# Altium schematic sheet pca10184_level_shifters.SchDoc: =ProductName + ' - Level Shifters'
size A3; Organization: Nordic Semiconductor; DocumentNumber: 4; SheetNumber: 4; SheetTotal: 9; CompanyName: Nordic Semiconductor; DocumentSize: A4
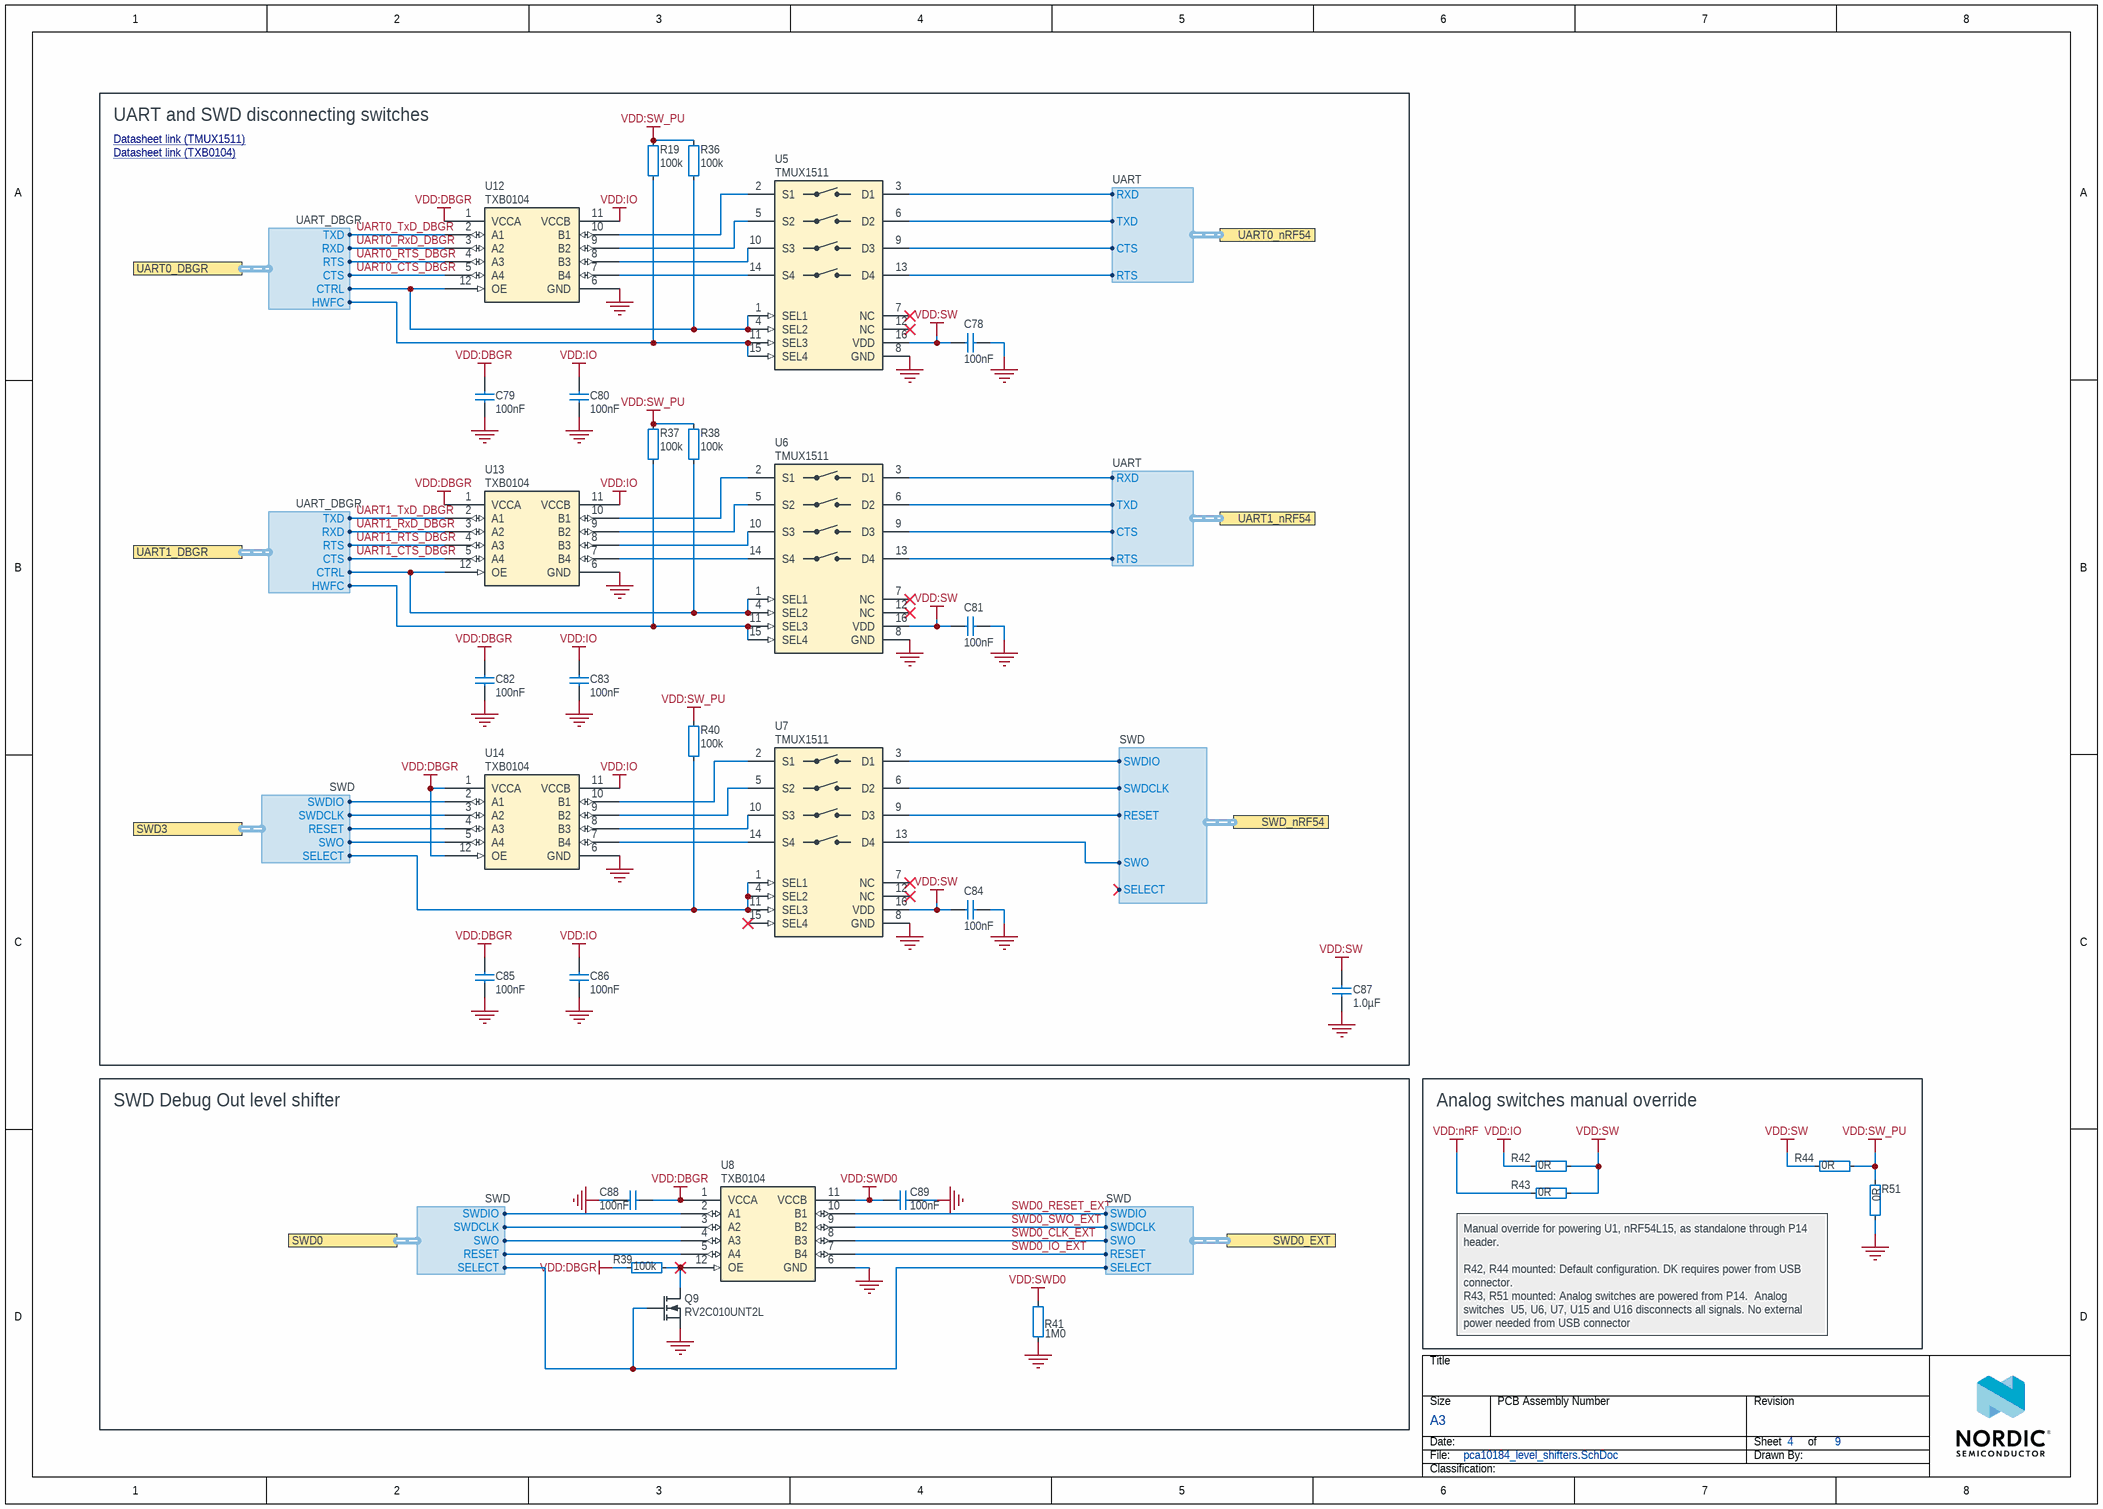
[diagram p0: pca10184_level_shifters.SchDoc]

## Parts
C78  100nF  [CAPC0603X03L_C]
C79  100nF  [CAPC0603X03L_C]
C80  100nF  [CAPC0603X03L_C]
C81  100nF  [CAPC0603X03L_C]
C82  100nF  [CAPC0603X03L_C]
C83  100nF  [CAPC0603X03L_C]
C84  100nF  [CAPC0603X03L_C]
C85  100nF  [CAPC0603X03L_C]
C86  100nF  [CAPC0603X03L_C]
C87  1.0µF  [CAPC1005X04L]
C88  100nF  [CAPC0603X03L_C]
C89  100nF  [CAPC0603X03L_C]
Q9  RV2C010UNT2L  [DFN65P100X40-3L]
R19  100k  [RESC0603X03L_C]
R36  100k  [RESC0603X03L_C]
R37  100k  [RESC0603X03L_C]
R38  100k  [RESC0603X03L_C]
R39  100k  [RESC0603X03L_C]
R40  100k  [RESC0603X03L_C]
R41  1M0  [RESC0603X03L_C]
R42  0R  [RESC1005X04L]
R43  0R  [RESC1005X04L]
R44  0R  [RESC1005X04L]
R51  0R  [RESC1005X04L]
U5  TMUX1511  [XQFN40P180X260X50-16N]
U6  TMUX1511  [XQFN40P180X260X50-16N]
U7  TMUX1511  [XQFN40P180X260X50-16N]
U8  TXB0104  [QFN12P40_170X200X55L50X20]
U12  TXB0104  [QFN12P40_170X200X55L50X20]
U13  TXB0104  [QFN12P40_170X200X55L50X20]
U14  TXB0104  [QFN12P40_170X200X55L50X20]

## Blocks framed on the sheet
UART and SWD disconnecting switches: C78-C87 R19 R36-R38 R40 U5-U7 U12-U14
SWD Debug Out level shifter: C88 C89 Q9 R39 R41 U8
Analog switches manual override: R42-R44 R51

## Ports
SWD0 (harness SWD), SWD0_EXT (harness SWD), SWD3 (harness SWD), SWD_nRF54 (harness SWD), UART0_DBGR (harness UART_DBGR), UART0_nRF54 (harness UART), UART1_DBGR (harness UART_DBGR), UART1_nRF54 (harness UART)

## Harnesses
SWD: SWDIO, SWDCLK, SWO, RESET, SELECT
UART_DBGR: RTS, CTS, RXD, TXD, HWFC, CTRL
UART: RTS, CTS, RXD, TXD

## Nets
GND: C78.2 C79.2 C80.2 C81.2 C82.2 C83.2 C84.2 C85.2 C86.2 C87.1 C88.1 C89.2 Q9.2(S) R41.1 R51.2 U5.8(GND) U6.8(GND) U7.8(GND) U8.6(GND) U12.6(GND) U13.6(GND) U14.6(GND)
VDD:DBGR: C79.1 C82.1 C85.1 C88.2 R39.2 U8.1(VCCA) U12.1(VCCA) U13.1(VCCA) U14.1(VCCA) U14.12(OE)
VDD:IO: C80.1 C83.1 C86.1 R42.1 U12.11(VCCB) U13.11(VCCB) U14.11(VCCB)
VDD:nRF: R43.1
VDD:SW: C78.1 C81.1 C84.1 C87.2 R42.2 R43.2 R44.2 U5.16(VDD) U6.16(VDD) U7.16(VDD)
VDD:SW_PU: R19.1 R36.1 R37.1 R38.1 R40.1 R44.1 R51.1
VDD:SWD0: C89.1 R41.2 U8.11(VCCB)
SWD0_CLK_EXT: U8.8(B3) ; port SWD0_EXT.SWO
SWD0_IO_EXT: U8.7(B4) ; port SWD0_EXT.RESET
SWD0_RESET_EXT: U8.10(B1) ; port SWD0_EXT.SWDIO
SWD0_SWO_EXT: U8.9(B2) ; port SWD0_EXT.SWDCLK
UART0_CTS_DBGR: U12.5(A4) ; port UART0_DBGR.CTS
UART0_RTS_DBGR: U12.4(A3) ; port UART0_DBGR.RTS
UART0_RxD_DBGR: U12.3(A2) ; port UART0_DBGR.RXD
UART0_TxD_DBGR: U12.2(A1) ; port UART0_DBGR.TXD
UART1_CTS_DBGR: U13.5(A4) ; port UART1_DBGR.CTS
UART1_RTS_DBGR: U13.4(A3) ; port UART1_DBGR.RTS
UART1_RxD_DBGR: U13.3(A2) ; port UART1_DBGR.RXD
UART1_TxD_DBGR: U13.2(A1) ; port UART1_DBGR.TXD
NetQ9_1: Q9.1(G) ; port SWD0.SELECT, port SWD0_EXT.SELECT
NetQ9_3: Q9.3(D) R39.1 U8.12(OE)
NetR19_2: R19.2 U5.11(SEL3) U5.15(SEL4) ; port UART0_DBGR.HWFC
NetR36_2: R36.2 U5.1(SEL1) U5.4(SEL2) U12.12(OE) ; port UART0_DBGR.CTRL
NetR37_2: R37.2 U6.11(SEL3) U6.15(SEL4) ; port UART1_DBGR.HWFC
NetR38_2: R38.2 U6.1(SEL1) U6.4(SEL2) U13.12(OE) ; port UART1_DBGR.CTRL
NetR40_2: R40.2 U7.1(SEL1) U7.4(SEL2) U7.11(SEL3) ; port SWD3.SELECT
NetU5_2: U5.2(S1) U12.10(B1)
NetU5_3: U5.3(D1) ; port UART0_nRF54.RXD
NetU5_5: U5.5(S2) U12.9(B2)
NetU5_6: U5.6(D2) ; port UART0_nRF54.TXD
NetU5_9: U5.9(D3) ; port UART0_nRF54.CTS
NetU5_10: U5.10(S3) U12.8(B3)
NetU5_13: U5.13(D4) ; port UART0_nRF54.RTS
NetU5_14: U5.14(S4) U12.7(B4)
NetU6_2: U6.2(S1) U13.10(B1)
NetU6_3: U6.3(D1) ; port UART1_nRF54.RXD
NetU6_5: U6.5(S2) U13.9(B2)
NetU6_6: U6.6(D2) ; port UART1_nRF54.TXD
NetU6_9: U6.9(D3) ; port UART1_nRF54.CTS
NetU6_10: U6.10(S3) U13.8(B3)
NetU6_13: U6.13(D4) ; port UART1_nRF54.RTS
NetU6_14: U6.14(S4) U13.7(B4)
NetU7_2: U7.2(S1) U14.10(B1)
NetU7_3: U7.3(D1) ; port SWD_nRF54.SWDIO
NetU7_5: U7.5(S2) U14.9(B2)
NetU7_6: U7.6(D2) ; port SWD_nRF54.SWDCLK
NetU7_9: U7.9(D3) ; port SWD_nRF54.RESET
NetU7_10: U7.10(S3) U14.8(B3)
NetU7_13: U7.13(D4) ; port SWD_nRF54.SWO
NetU7_14: U7.14(S4) U14.7(B4)
NetU8_2: U8.2(A1) ; port SWD0.SWDIO
NetU8_3: U8.3(A2) ; port SWD0.SWDCLK
NetU8_4: U8.4(A3) ; port SWD0.SWO
NetU8_5: U8.5(A4) ; port SWD0.RESET
NetU14_2: U14.2(A1) ; port SWD3.SWDIO
NetU14_3: U14.3(A2) ; port SWD3.SWDCLK
NetU14_4: U14.4(A3) ; port SWD3.RESET
NetU14_5: U14.5(A4) ; port SWD3.SWO

Not connected (* = marked no-connect by the designer): U5 7(NC)* 12(NC)*; U6 7(NC)* 12(NC)*; U7 7(NC)* 12(NC)* 15(SEL4)*

## Notes on the sheet
- Datasheet link (TMUX1511) <https://www.ti.com/lit/ds/symlink/tmux1511.pdf?ts=1730882090102&ref_url=https%253A%252F%252Fwww.mouser.dk%252F>
- Datasheet link (TXB0104) <https://www.ti.com/lit/ds/symlink/txb0104.pdf?src-supplier=IHS+Markit>
- (near R43) Manual override for powering U1, nRF54L15, as standalone through P14 header.
  R42, R44 mounted: Default configuration. DK requires power from USB connector.
  R43, R51 mounted: Analog switches are powered from P14.  Analog switches  U5, U6, U7, U15 and U16 disconnects all signals. No external power needed from USB connector
- Title
- Size
- Date:
- File:
- A3
- PCB Assembly Number
- Sheet
- Drawn By:
- Revision
- of
- Classification:

## Library data of the parts
C78-C86 C88 C89 = C0201-100n: Capacitor, X5R, ±10%; Manufacturer: N.A.; Part number IPS: 00000001248, 00000002505; Part number Norautron: 262071862; Part number NEMS: 100200078; Pad Count: 2; Note: 16V; Component Status: Active; Part Number: C0201-100n; Value: 100nF; Footprint Doc: 0201; Component Class: Capacitors; Author: rsk; PartId: 100200078; Manufacturer Part Number: N.A.; ComponentLink1URL: N.A.; ComponentLink1Description: Datasheet; ComponentLink2URL: N.A.; ComponentLink2Description: Supplier link; HelpURL: N.A.; LatestRevisionDate: 2017-11-09; Published: 2014-11-13; Supplier 1: N.A.; Supplier Part Number 1: N.A.; Supplier 2: N.A.; Supplier Part Number 2: N.A.; Artikkelnr Noca: N.A.
C87 = C0402-1µ0-6.3V-X5R-10%: Capacitor, X5R, ±10%, 6.3V; Manufacturer: N.A.; Part number Norautron: 26207137; Part number NEMS: 100200498; Pad Count: 2; Component Status: Active; Part Number: C0402-1µ0-6.3V-X5R-10%; Manufacturer Part Number: N.A.; LatestRevisionDate: 2022-01-27; Published: 2022-01-27; Value: 1.0µF; Note: 6.3V; Artikkelnr Noca: N.A.; Footprint Doc: 0402; ComponentLink1URL: N.A.; ComponentLink1Description: Datasheet; ComponentLink2URL: N.A.; ComponentLink2Description: Supplier link; HelpURL: N.A.; Supplier 1: N.A.; Supplier Part Number 1: N.A.; Supplier 2: N.A.; Supplier Part Number 2: N.A.; Part number IPS: N.A.; Component Class: Capacitors; PartId: 100200498; Author: rubr
Q9 = RV2C010UNT2L: N-Channel MOSFET, 20V, 1A, 470mOhm, 400mW, -55°C ~ 150°C; Manufacturer: Rohm Semiconductor; Part number IPS: 00000009976; Part number Norautron: 26320026; Part number NEMS: 101300132; Note: N.A.; Artikkelnr Noca: 35010020; Pad Count: 3; Component Status: Active; Part Number: RV2C010UNT2L; Manufacturer Part Number: RV2C010UNT2L; ComponentLink1URL: N.A.; ComponentLink1Description: Datasheet; ComponentLink2URL: N.A.; ComponentLink2Description: Supplier link; HelpURL: http://rohmfs.rohm.com/en/products/databook/datasheet/discrete/transistor/mosfet/rv2c010unt2l-e.pdf; Footprint Doc: DFN-3; LatestRevisionDate: 2024-09-18; Published: 2016-08-09; Value: RV2C010UNT2L; Supplier 1: Digi-Key; Supplier Part Number 1: RV2C010UNT2LCT-ND; Supplier 2: Mouser; Supplier Part Number 2: 755-RV2C010UNT2L; PartId: 101300132; Component Class: Semiconductors; Author: rsk
R19 R36-R40 = R0201-100k: Resistor, ±1%, 0.05W; Manufacturer: N.A.; Part number IPS: 00000001419; Part number Norautron: 26108487; Part number NEMS: 100100080; Note: Chip Res 1%; Pad Count: 2; Component Status: Active; Part Number: R0201-100k; Manufacturer Part Number: N.A.; ComponentLink1URL: N.A.; ComponentLink1Description: Datasheet; ComponentLink2URL: N.A.; ComponentLink2Description: Supplier link; HelpURL: N.A.; Footprint Doc: 0201; LatestRevisionDate: 2014-11-13; Published: 2014-11-13; Value: 100k; Artikkelnr Noca: N.A.; Supplier 1: N.A.; Supplier Part Number 1: N.A.; Supplier 2: N.A.; Supplier Part Number 2: N.A.; Component Class: Resistors; PartId: 100100080; Author: rsk
R41 = R0201-1M0: Resistor, ±1%, 0.05W; Manufacturer: N.A.; Part number IPS: 00000001418; Part number Norautron: 26107108; Part number NEMS: 100100093; Component Status: Active; Pad Count: 2; Note: Chip Res 1%; Part Number: R0201-1M0; PartId: 100100093; Component Class: Resistors; Author: rsk; Manufacturer Part Number: N.A.; ComponentLink1URL: N.A.; ComponentLink1Description: Datasheet; ComponentLink2URL: N.A.; ComponentLink2Description: Supplier link; HelpURL: N.A.; LatestRevisionDate: 2014-11-13; Published: 2014-11-13; Footprint Doc: 0201; Value: 1M0; Supplier 1: N.A.; Supplier Part Number 1: N.A.; Supplier 2: N.A.; Supplier Part Number 2: N.A.; Artikkelnr Noca: N.A.
R42-R44 R51 = R0402-0R: Resistor, ±5%, 0.063W; Manufacturer: N.A.; Part number IPS: 00000007128; Part number NEMS: 100100109; Component Status: Active; Pad Count: 2; Note: Chip Res 5%; Artikkelnr Noca: 27049000; Part Number: R0402-0R; PartId: 100100109; Component Class: Resistors; Author: rsk; Manufacturer Part Number: N.A.; ComponentLink1URL: N.A.; ComponentLink1Description: Datasheet; ComponentLink2URL: N.A.; ComponentLink2Description: Supplier link; HelpURL: N.A.; LatestRevisionDate: 2009-11-23; Published: 2009-05-08; Footprint Doc: 0402; Value: 0R; Supplier 1: Farnell; Supplier Part Number 1: 146-9661; Supplier 2: N.A.; Supplier Part Number 2: N.A.; Part number Norautron: N.A.
U5-U7 = TMUX1511: Low-Capacitance, 1:1 (SPST) 4-Channel, analog switch; Manufacturer: Texas Instruments; Manufacturer Part Number: TMUX1511RSVR; Part number NEMS: 101900847; Component Status: Active; Pad Count: 16; Note: N.A.; Part Number: TMUX1511; Component Class: Misc_ICs; Author: stl1; ComponentLink1URL: https://www.ti.com/lit/ds/symlink/tmux1511.pdf?ts=1730882090102&ref_url=https%253A%252F%252Fwww.mouser.dk%252F; ComponentLink1Description: Datasheet; ComponentLink2URL: N.A.; ComponentLink2Description: Supplier link; HelpURL: https://www.ti.com/lit/ds/symlink/tmux1511.pdf?ts=1730882090102&ref_url=https%253A%252F%252Fwww.mouser.dk%252F; LatestRevisionDate: 2024-12-05; Published: 2024-12-05; Footprint Doc: UFQFN-16; Value: TMUX1511; Supplier 1: Digi-Key; Supplier Part Number 1: 296-53443-2-ND; Supplier 2: Mouser; Supplier Part Number 2: 595-TMUX1511RSVR; Artikkelnr Noca: N.A.; Part number IPS: N.A.; Part number Norautron: N.A.; PartId: 101900847
U8 U12-U14 = TXB0104RUTR: 4-Bit Bidirectional Level-Shifter/Voltage Translator with Automatic Direction Sensing; Manufacturer: Texas Instruments; Part number NEMS: 101900856; Component Status: Active; Pad Count: 12; Note: Translator, Bidirectional; Artikkelnr Noca: N.A.; Part Number: TXB0104RUTR; Component Class: Misc_ICs; Author: stl1; Manufacturer Part Number: TXB0104RUTR; ComponentLink1URL: N.A.; ComponentLink1Description: Datasheet; ComponentLink2URL: N.A.; ComponentLink2Description: Supplier link; HelpURL: https://www.ti.com/lit/ds/symlink/txb0104.pdf?ts=1738584719537&ref_url=https%253A%252F%252Fwww.mouser.com%252F; LatestRevisionDate: 2025-02-04; Published: 2025-02-04; Footprint Doc: 12-UFQFN; Value: TXB0104; Supplier 1: Digi-Key; Supplier Part Number 1: 296-25888-2-ND; Supplier 2: Mouser; Supplier Part Number 2: 595-TXB0104RUTR; Part number IPS: N.A.; Part number Norautron: N.A.; PartId: 101900856